# Altium project Project_17.PrjPcb
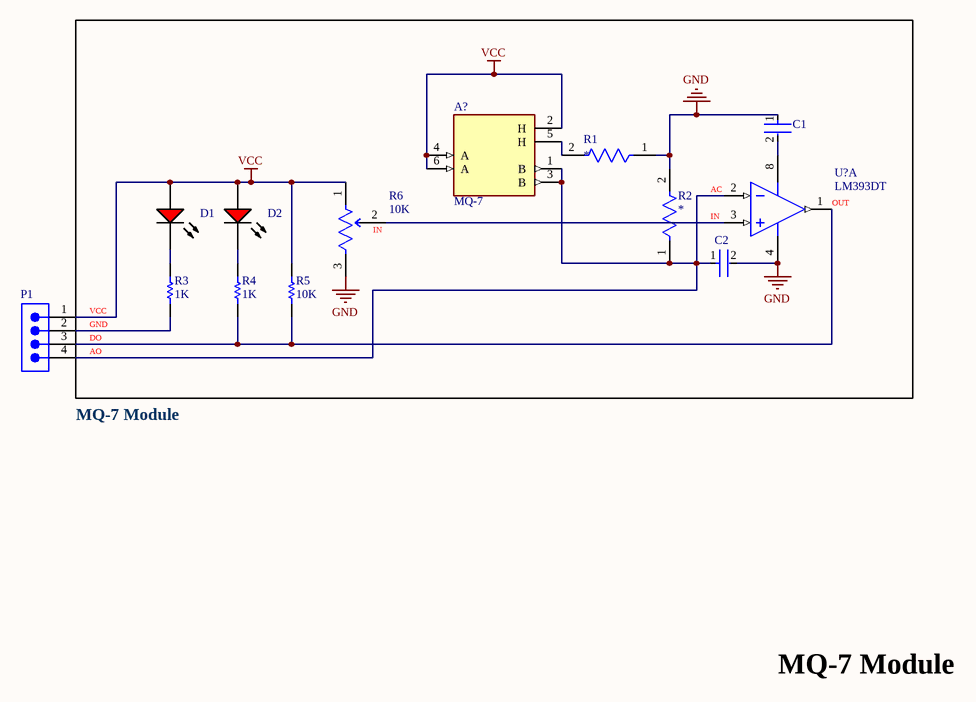
[diagram p0: MQ_7.SchDoc]
3 sheets, 32 parts. Net scope: global (net labels, ports and power ports of the same name join across sheets).
Board file: Project17.PcbDoc
Sheets:
  MQ_7.SchDoc
  MPU_6050.SchDoc
  LoRa_SX1278.SchDoc

## Sheet MQ_7.SchDoc
size A; SheetNumber: 1; SheetTotal: 3

### Parts
(Parts that share a designator on the sheet are numbered #1, #2 ... from top to bottom, then left to right.)
A?  MQ-7  [XDCR_MQ-7]
C1#1  (no value)  [FP-C0402-BB-MFG]
C2#1  (no value)  [FP-C0402-BB-MFG]
D1  (no value)  [VISH-TLMX1100_V]
D2  (no value)  [VISH-TLMX1100_V]
P1#1  (no value)  [61300411121]
R1#1  *  [FP-AC0603-IPC_C]
R2#1  *  [FP-AC0603-IPC_C]
R3#1  1K  [RESC3116X65X40ML10T20]
R4#1  1K  [RESC3116X65X40ML10T20]
R5  10K  [RESC3116X65X40ML10T20]
R6  10K  [FP-3314J-1-MFG]
U?#1  LM393DT  [STM-SO-8_D_L]  (part A of 2)

### Nets
GND: C1#1.1 C2#1.2 R1#1.1 R2#1.2 R6.3(CW) U?#1.4(VCC-)
VCC: A?.2(H) A?.4(A) A?.6(A) D1.1(A) D2.1(A) P1#1.1 R5.2 R6.1(CCW)
NetA?_1: A?.1(B) A?.3(B) C2#1.1 P1#1.4 R2#1.1 U?#1.2(IN1-)
NetA?_5: A?.5(H) R1#1.2
NetC1#1_2: C1#1.2 U?#1.8(VCC+)
NetD1_2: D1.2(K) R3#1.2
NetD2_2: D2.2(K) R4#1.2
NetP1#1_2: P1#1.2 R3#1.1
NetP1#1_3: P1#1.3 R4#1.1 R5.1 U?#1.1(OUT1)
NetR6_2: R6.2(WIPER) U?#1.3(IN1+)

### Notes on the sheet
- AC
- (near R6) IN
- IN
- (near U?#1) OUT
- (near P1#1) GND
- (near P1#1) VCC
- (near P1#1) DO
- (near P1#1) AO
- MQ-7 Module

### Library data of the parts
A? = MQ-7: Gas Sensor, High sensitivity to carbon monoxide; MF: Hanwei Electronics Co., Ltd; SnapEDA_Link: https://www.snapeda.com/parts/MQ-7/Hanwei+Electronics+Co.%252C+Ltd/view-part/?ref=snap; Package: Package; Value: *; MP: MQ-7; Check_prices: https://www.snapeda.com/parts/MQ-7/Hanwei+Electronics+Co.%252C+Ltd/view-part/?ref=eda
C1#1 C2#1 = CMP-2008-02046-2: CAP CER 0.1UF 10V X5R 0402; Manufacturer: Kemet; Manufacturer Part Number: C0402C104K8PACTU; Material: Ceramic; Capacitance: 0.10 μF; Temperature Coefficient: 15%; Description: C0402 0.10 μF X5R 10.00% 10 V; Tolerance: 0.1; Value: 0.10 μF; Package: C0402-BB; Temperature: -55°C to +125°C; ComponentLink2Description: Datasheet; Temperature Characteristic: X5R; Device Class L1: Passive Components; Height: 0.55mm; Lead Free: Yes; ComponentLink2URL: https://content.kemet.com/datasheets/KEM_C1002_X7R_SMD.pdf; Device Class L2: Capacitors; Temperature Range Low: -55°C; Temperature Range High: +125°C; RoHS: TRUE; Octopart: https://octopart.com/c0402c104k8pactu-kemet-140039; Automotive: No; Mouser Description: Capacitor 100 nF 10 VDC 0402; Category: Cap; Voltage Rating: 10 V; Digikey Description: CAP CER 0.1UF 10V X5R 0402; Ipc Land Pattern Name: CAPC10050X50; Device Class L3: Ceramic Capacitors
D1 D2 = CMP-1666-00027-1: LED, RED, 2.1 V, -40 to 100 degC, 2-Pin SMD (0603), RoHS, Tape and Reel; Type (Capacitors): C0G; Resistance: 100000000000 Ohm; Capacitance: 12 pF; Voltage Rating: 50 V; Tolerance: 5%; Min Operating Temperature: -55degC; REACH SVHC: No SVHC; ComponentLink2Description: Datasheet; ComponentLink1URL: http://www.vishay.com/; Width: 0.8 mm; Package Quantity: 4000; PackageReference: TLMX1100; ComponentLink2URL: http://www.vishay.com/docs/83173/tlmb1100.pdf; Case/Package: 0603; Case Code (Metric): 1608; Packaging: Tape and Reel; Pins: 2; ComponentLink1Description: Manufacturer URL; Max Operating Temperature: 125degC; Height: 0.8 mm; Length: 1.6 mm; Mount: Surface Mount; PackageDescription: 2-Pin Surface Mount Device, Body 1.6 x 0.8 mm; DatasheetVersion: Rev. 2.7, 03/2016; Case Code (Imperial): 0603; Voltage Rating (DC): 50 V; RoHSCompliant: True; Radiation Hardening: No
P1#1 = CMP-1502-01064-3: NexarPartId: 32855522; Operating Supply Voltage: 250V; Pitch: 2.54mm; Contact Resistance: 20mΩ; Number of Positions: 4; Current Rating: 3A; Connector Type: Male Pin; Gender: Male; Contact Plating: Gold; Height: 8.89mm; Lead Pitch: 2.54mm; Lead Free: Lead Free; Contact Mating Length: 5.9944mm; Number of Rows: 1; Termination: Solder; Packaging: Bulk; REACH SVHC: Unknown; Min Operating Temperature: -40°C; RoHS: Compliant; Number of Contacts: 4; Voltage Rating: 250V; Color: Black; Max Operating Temperature: 105°C; Contact Material: Copper; Mount: Through Hole; Orientation: Vertical; Number of Pins: 4
R1#1 R2#1 = CMP-2000-04844-3: RES 47KΩ 1.00% 0.1W 0603; Tolerance: 1%; Max Power Dissipation: 100mW; Resistance: 47kR; Voltage Rating: 50V; Temperature Coefficient: 100ppm/°C; Radiation Hardening: No; Weight: 7.1E-05oz; Case Code (Imperial): 0603; RoHS Compliant: Yes; Features: Moisture Resistant; Packaging: Tape and Reel; Number of Terminations: 2; Termination: SMD/SMT; Construction: Rectangular; Military Standard: Not; Series: AC; Min Operating Temperature: -55°C; Power Rating: 100mW; Lead Free: Lead Free; Case Code (Metric): 1608; Length: 1.6mm; Max Operating Temperature: 155°C; Ratings: AEC-Q200; Width: 0.8mm; Depth: 0.8mm; Height: 0.45mm; Case/Package: 0603; Resistor Type: Thick Film; Contact Plating: Tin
R3#1 R4#1 R5 = CMP-2100-03678-1: Chip Resistor, 1 KOhm, +/- 1%, 0.25 W, -55 to 155 degC, 1206 (3216 Metric), RoHS, Tape and Reel; Manufacturer: Yageo; Temperature Coefficient: 100ppm/degreesC; Power Rating: 250mW; Voltage Rating: 200V; Resistance: 1KOhm; Composition: ThickFilm; Min Operating Temperature: -55degC; Tolerance: 1%; REACH SVHC: Unknown; Case Code (Metric): 3216; Military Standard: Not; Datasheet Version: Rev. 5, 10/2016; Package Reference: 1206.0; Case/Package: 1206; Length: 3.1mm; Manufacturer URL: http://www.yageo.com/; Lead Free: LeadFree; RoHSCompliant: true; Termination: SMD/SMT; Packaging: TapeandReel; Package Description: 2-Pin Surface Mount Device, Body 3.1 x 1.6 mm; Depth: 1.6mm; Case Code (Imperial): 1206; Max Operating Temperature: 155degC; Datasheet URL: http://www.yageo.com/NewPortal/yageodocoutput?fileName=/pdf/R-Chip/PYu-RC_Group_51_RoHS_L_5.pdf; Height: 0.55mm
R6 = CMP-07234-000035-1: TRIMMER 10K OHM 0.25W J LEAD TOP; RoHS Compliant: Yes
U?#1 = CMP-2000-06550-1: Low-Power, Dual-Voltage Comparator, 2 to 36 V, 0 to 70 degC, 8-Pin SOIC (SO), RoHS, Tape and Reel; Manufacturer: STMicroelectronics; Voltage - Supply, Single/Dual (±): 2V~36V,±1V~18V; Current - Input Bias (Max): 0.25µA@5V; Number of Elements: 2; Current - Output (Typ): 18mA@5V; Other Names: 497-1593-2; Voltage - Input Offset (Max): 5mV@30V; Output Type: CMOS,DTL,ECL,MOS,Open-Collector,TTL; EDA / CAD Models: DownloadfromAcceleratedDesigns; Other Related Documents: LM393ViewAllSpecificationsLM393ViewAllSpecifications; Online Catalog: Comparators-2elements; Current - Quiescent (Max): 2.5mA; Standard Package: 2,500; Manufacturer URL: http://www.st.com/; Package Description: 8-Pin Small Outline Integrated Circuit, Body 4.9 x 3.9 mm, Pitch 1.27 mm; Packaging: Tape&Reel(TR); Datasheet Version: Rev. 15, 02/2016; Category: IntegratedCircuits(ICs); Operating Temperature: 0°C~70°C; Mounting Type: SurfaceMount; Supplier Device Package: 8-SO; Datasheet URL: http://www.st.com/content/ccc/resource/technical/document/datasheet/group1/b4/cc/cf/13/18/28/44/f5/CD00000465/files/CD00000465.pdf/jcr:content/translations/en.CD00000465.pdf; Family: Linear-Comparators; Mounting Technology: SurfaceMount; Type: GeneralPurpose; Package Reference: SO-8; Package / Case: 8-SOIC(0.154",3.90mmWidth)

## Sheet MPU_6050.SchDoc
size A; SheetNumber: 2; SheetTotal: 3
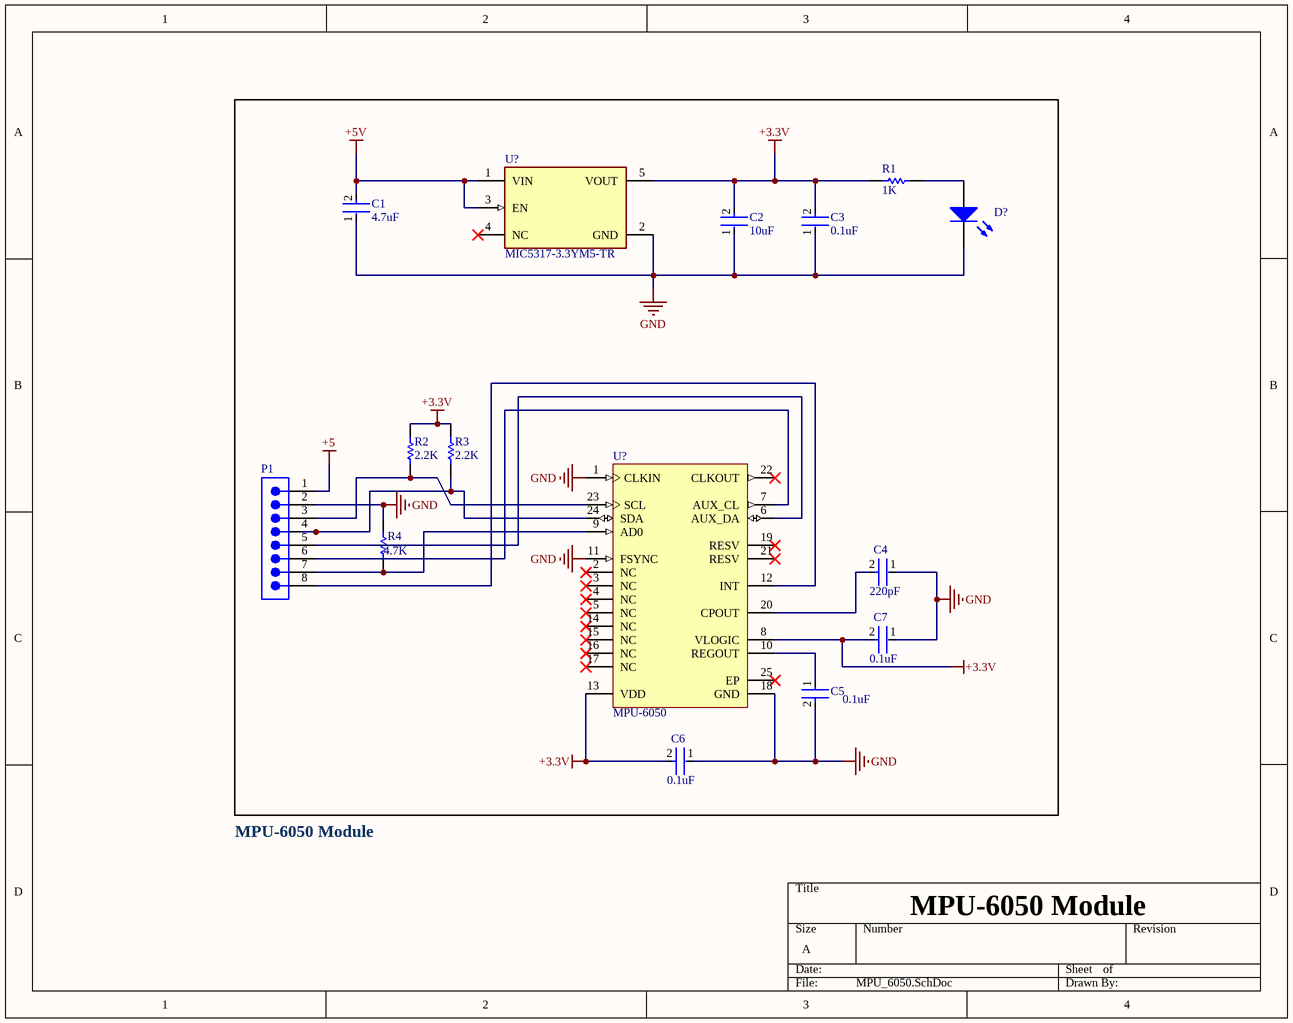
[diagram p1: MPU_6050.SchDoc]

### Parts
(Parts that share a designator on the sheet are numbered #1, #2 ... from top to bottom, then left to right.)
C1#2  4.7uF  [FP-GRM15-MFG]
C2#2  10uF  [FP-GRM15-MFG]
C3  0.1uF  [FP-GRM15-MFG]
C4  220pF  [FP-GRM15-MFG]
C5  0.1uF  [FP-GRM15-MFG]
C6  0.1uF  [FP-GRM15-MFG]
C7  0.1uF  [FP-GRM15-MFG]
D?  Light-Emitting Diode  (value not drawn)
P1#2  (no value)  [61300811121]
R1#2  1K  [RESC2013X60X35ML10T20]
R2#2  2.2K  [RESC2013X60X35ML10T20]
R3#2  2.2K  [RESC2013X60X35ML10T20]
R4#2  4.7K  [RESC2013X60X35ML10T20]
U?#2  MIC5317-3.3YM5-TR  [FP-SOT23-5LD-PL-1-MFG]
U?#3  MPU-6050  [IS-QFN-24_V]

### Nets
+3.3V: C2#2.2 C3.2 C6.2 C7.2 R1#2.1 R2#2.2 R3#2.2 U?#2.5(VOUT) U?#3.8(VLOGIC) U?#3.13(VDD)
+5: P1#2.1
+5V: C1#2.2 U?#2.1(VIN) U?#2.3(EN)
GND: C1#2.1 C2#2.1 C3.1 C4.1 C5.2 C6.1 C7.1 D?.2(K) P1#2.2 R4#2.2 U?#2.2(GND) U?#3.1(CLKIN) U?#3.11(FSYNC) U?#3.18(GND)
NetC4_2: C4.2 U?#3.20(CPOUT)
NetC5_1: C5.1 U?#3.10(REGOUT)
NetD?_1: D?.1(A) R1#2.2
NetP1#2_3: P1#2.3 R2#2.1 U?#3.23(SCL)
NetP1#2_4: P1#2.4 R3#2.1 U?#3.24(SDA)
NetP1#2_5: P1#2.5 U?#3.6(AUX_DA)
NetP1#2_6: P1#2.6 U?#3.7(AUX_CL)
NetP1#2_7: P1#2.7 R4#2.1 U?#3.9(AD0)
NetP1#2_8: P1#2.8 U?#3.12(INT)

Not connected (* = marked no-connect by the designer): U?#2 4(NC)*; U?#3 2(NC)* 3(NC)* 4(NC)* 5(NC)* 14(NC)* 15(NC)* 16(NC)* 17(NC)* 19(RESV)* 21(RESV)* 22(CLKOUT)* 25(EP)*

### Notes on the sheet
- MPU-6050 Module

### Library data of the parts
C1#2 C2#2 C3-C7 = CMP-2100-03641-2: CAP CER 0.1UF 16V X7R 0402; Manufacturer Part Number: GRM155R71C104KA88D; Manufacturer: Murata; Standoff Height: 0mm; Tolerance: 10%; Description: CAP Ceramic 0.10μF 10% X7R 16Vdc 0402 SMD; Voltage Rating: 16Vdc; Material: Ceramic; Capacitance: 0.10μF; Value: 0.10μF; RoHS: TRUE; Temperature Characteristic: X7R; Octopart: https://octopart.com/grm155r71c104ka88d-murata-196880; Digikey Description: CAP CER 0.1UF 16V X7R 0402; Device Class L3: Ceramic Capacitors; Height: 0.55mm; ComponentLink2Description: Datasheet; Temperature Range Low: -55°C; Ipc Land Pattern Name: CAPC10050X219; ComponentLink2URL: https://search.murata.co.jp/Ceramy/image/img/A01X/G101/ENG/GRM155R71H471KA01-01A.pdf; Device Class L1: Passive Components; Lead Free: yes; Category: Cap; Package: GRM15; Temperature: -55°C to +125°C; Device Class L2: Capacitors; Temperature Range High: +125°C; Mouser Description: 0402 0.1 uF 16V ±10 % Tolerance X7R SMT Multilayer Ceramic Capacitor
D? = LED: AF: 1; BV: 0; BV_MAX: 1e99; EG: 1.11; FC: 0.5; IBV: 0.001; IS: 1e-14; MJSW: 0.33; NTUN: 30; TNOM: 27; XTI: 3; SimulationGenericComponent: True; CJO: 0; CJP: 0; CTA: 0; CTP: 0; FCS: 0.5; FV_MAX: 1e99; IKF: 0; IKR: 0; ISR: 1e-14; JSW: 0; JTUN: 0; JTUNSW: 0; KEG: 1; KF: 0; LEVEL: 1; N: 1; NBV: 1; NR: 1; NS: 1; PHP: 1; RS: 0; TCV: 0; TLEV: 0; TLEVC: 0; TM1: 0; TM2: 0; TPB: 0; TPHP: 0; TRS: 0; TRS2: 0; TT: 0; TTT1: 0; TTT2: 0; VJ: 1; XTITUN: 3
P1#2 = CMP-1502-01076-3: NexarPartId: 32855533; Connector Type: Male Pin; Number of Contacts: 8; Voltage Rating: 250V; Current Rating: 3A; Contact Resistance: 20mΩ; Pitch: 2.54mm; Gender: Male; Termination: Solder; Contact Material: Copper; Mount: Through Hole; Lead Pitch: 2.54mm; Number of Positions: 8; Operating Supply Voltage: 250V; Number of Pins: 8; Max Operating Temperature: 105°C; Height: 8.54mm; REACH SVHC: Unknown; Number of Rows: 1; Packaging: Bulk; Contact Plating: Gold; Contact Mating Length: 5.9944mm; Orientation: Vertical; RoHS: Compliant; Color: Black; Min Operating Temperature: -40°C
R1#2 R2#2 R3#2 R4#2 = CMP-2100-03671-1: Chip Resistor, 1 KOhm, +/- 1%, 125 mW, -55 to 155 degC, 0805 (2012 Metric), RoHS, Tape and Reel; Manufacturer: Yageo; Temperature Coefficient: 100ppm/degreesC; Voltage Rating (DC): 150V; Max Power Dissipation: 125mW; Resistance: 1KOhm; Number of Pins: 2; Number of Terminations: 2; Datasheet URL: http://www.yageo.com/NewPortal/yageodocoutput?fileName=/pdf/R-Chip/PYu-RC_Group_51_RoHS_L_5.pdf; Length: 0.079inch; Package Description: 2-Pin Surface Mounted Device, Body 2 x 1.25 mm; Depth: 1.25mm; Height: 0.024inch; Military Standard: Not; Case/Package: 0805; Package Reference: 0805; RoHSCompliant: true; Lead Free: LeadFree; Packaging: TapeandReel; Package Quantity: 1; Datasheet Version: Rev. 5, 10/2016; Tolerance: 1%; Min Operating Temperature: -55degC; Voltage Rating: 150V; Composition: ThickFilm; Case Code (Imperial): 0805; Power Rating: 125mW; Width: 0.049inch; Case Code (Metric): 2012; Manufacturer URL: http://www.yageo.com/; Max Operating Temperature: 155degC; REACH SVHC: Unknown; Termination: SMD/SMT
U?#2 = CMP-06324-000116-1: IC REG LINEAR 3.3V 150MA SOT23-5; Max Input Voltage: 6V; Number of Regulators: 1; Min Current Limit: 200mA; Dropout Voltage: 155mV; Min Input Voltage: 2.5V; Power Supply Rejection Ratio (PSRR): 70dB; Case/Package: SOT-23-5; Output Voltage: 3.3V; Series: -; Max Operating Temperature: 125°C; Package Quantity: 3000; Mount: Surface Mount; Packaging: Tape and Reel; RoHS Compliant: No; Output Current: 150mA; Min Operating Temperature: -40°C; Number of Outputs: 1
U?#3 = CMP-1753-00002-2: 3-Axis Gyroscope, Accelerometer and a Digital Motion Processor(TM) (DMP), 2.375 to 3.46 V, -40 to 85 degC, 24-Pin QFN, RoHS, Tape and Reel; Manufacturer: InvenSense; Featured Product: MPU-60506-Axis,IntegratedI²CSolution; Other Names: 1428-1007-2 / MPU6050; Sensor Type: MotionTracking; Online Catalog: MPU-6000™Series; Unit PriceUSD: Digital; Datasheet Version: Rev. 3.3, 05/2012; Category: Sensors,Transducers; Datasheet URL: http://datasheet.octopart.com/MPU-6050-InvenSense-datasheet-14421344.pdf; Family: Multifunction; Standard Package: 5,000; Manufacturer URL: http://www.invensense.com/; Output Type: Digital; Dynamic Catalog: MPU-6000™Series

## Sheet LoRa_SX1278.SchDoc
size A; SheetNumber: 3; SheetTotal: 3
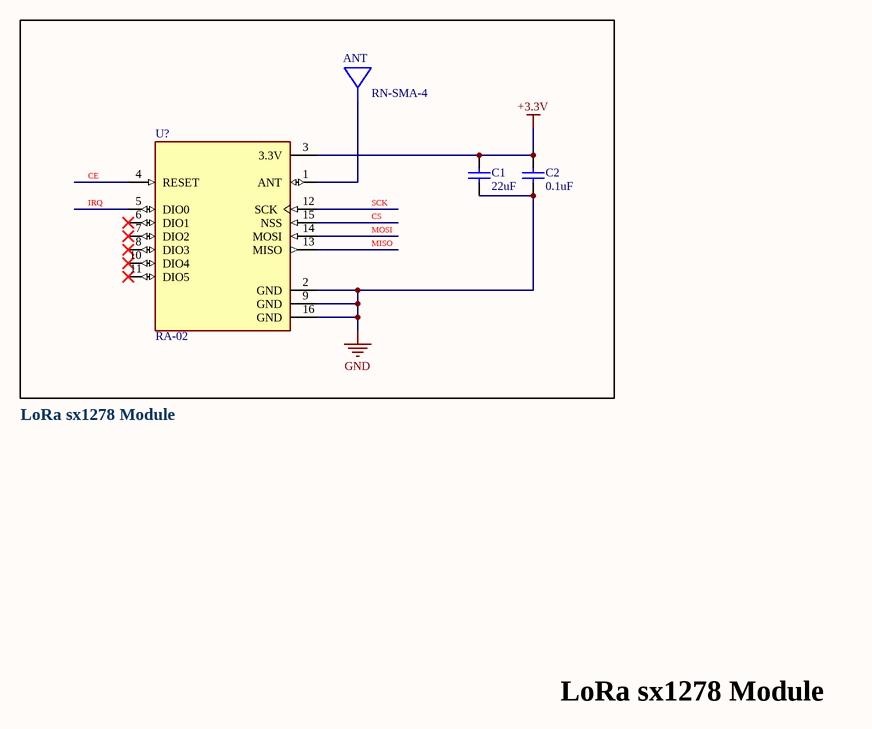
[diagram p2: LoRa_SX1278.SchDoc]

### Parts
(Parts that share a designator on the sheet are numbered #1, #2 ... from top to bottom, then left to right.)
ANT  RN-SMA-4  [FP-RN-SMA-4-MFG]
C1#3  value 22uF  (hidden comment: Capacitor)
C2#3  value 0.1uF  (hidden comment: Capacitor)
U?#4  RA-02  [XCVR_RA-01H]

### Nets
+3.3V: C1#3.2 C2#3.2 U?#4.3(3.3V)
GND: C1#3.1 C2#3.1 U?#4.2(GND) U?#4.9(GND) U?#4.16(GND)

Not connected (* = marked no-connect by the designer): U?#4 1(ANT) 4(RESET) 5(DIO0) 6(DIO1)* 7(DIO2)* 8(DIO3)* 10(DIO4)* 11(DIO5)* 12(SCK) 13(MISO) 14(MOSI) 15(NSS)

### Notes on the sheet
- CE
- IRQ
- SCK
- CS
- MOSI
- MISO
- LoRa sx1278 Module

### Library data of the parts
ANT = CMP-06329-000002-1: RF ANT 2.4GHZ WHIP SMA MALE 4"; Number of Bands: 1; Input Impedance: 50R; VSWR: 1.9; Bandwidth: 120MHz; Frequency: 2.45GHz; REACH SVHC: No SVHC; Height: 4.449inch; Packaging: Bulk; Case/Package: SMA; Package Quantity: 1; Lead Free: Lead Free; Series: -; Termination: SMA; Connector Type: SMA; Radiation Hardening: No; Impedance: 50R; Mount: Connector
C1#3 C2#3 = Capacitor: SimulationGenericComponent: True
U?#4 = RA-01H: MÃ´-Ä‘un thu phÃ¡t LoRaâ„¢ ISM < 1GHz chung KhÃ´ng bao gá»“m Äƒng-ten 803 MHz ~ 930 MHz GiÃ¡ treo bá» máº·t; MF: AI-Thinker; SnapEDA_Link: https://www.snapeda.com/parts/RA-01H/AI-Thinker/view-part/?ref=snap; Package: Package; Value: *; MP: RA-01H; Check_prices: https://www.snapeda.com/parts/RA-01H/AI-Thinker/view-part/?ref=eda

## Nets that join several sheets
+3.3V: MPU_6050 (10 pins), LoRa_SX1278 (C1#3.2 C2#3.2 U?#4.3)
GND: MQ_7 (6 pins), MPU_6050 (14 pins), LoRa_SX1278 (5 pins)